# EAGLE design ESP32-S2 Parallel TFT with Touch v1.1(3.5'' ili9488) (EAGLE 6.1)
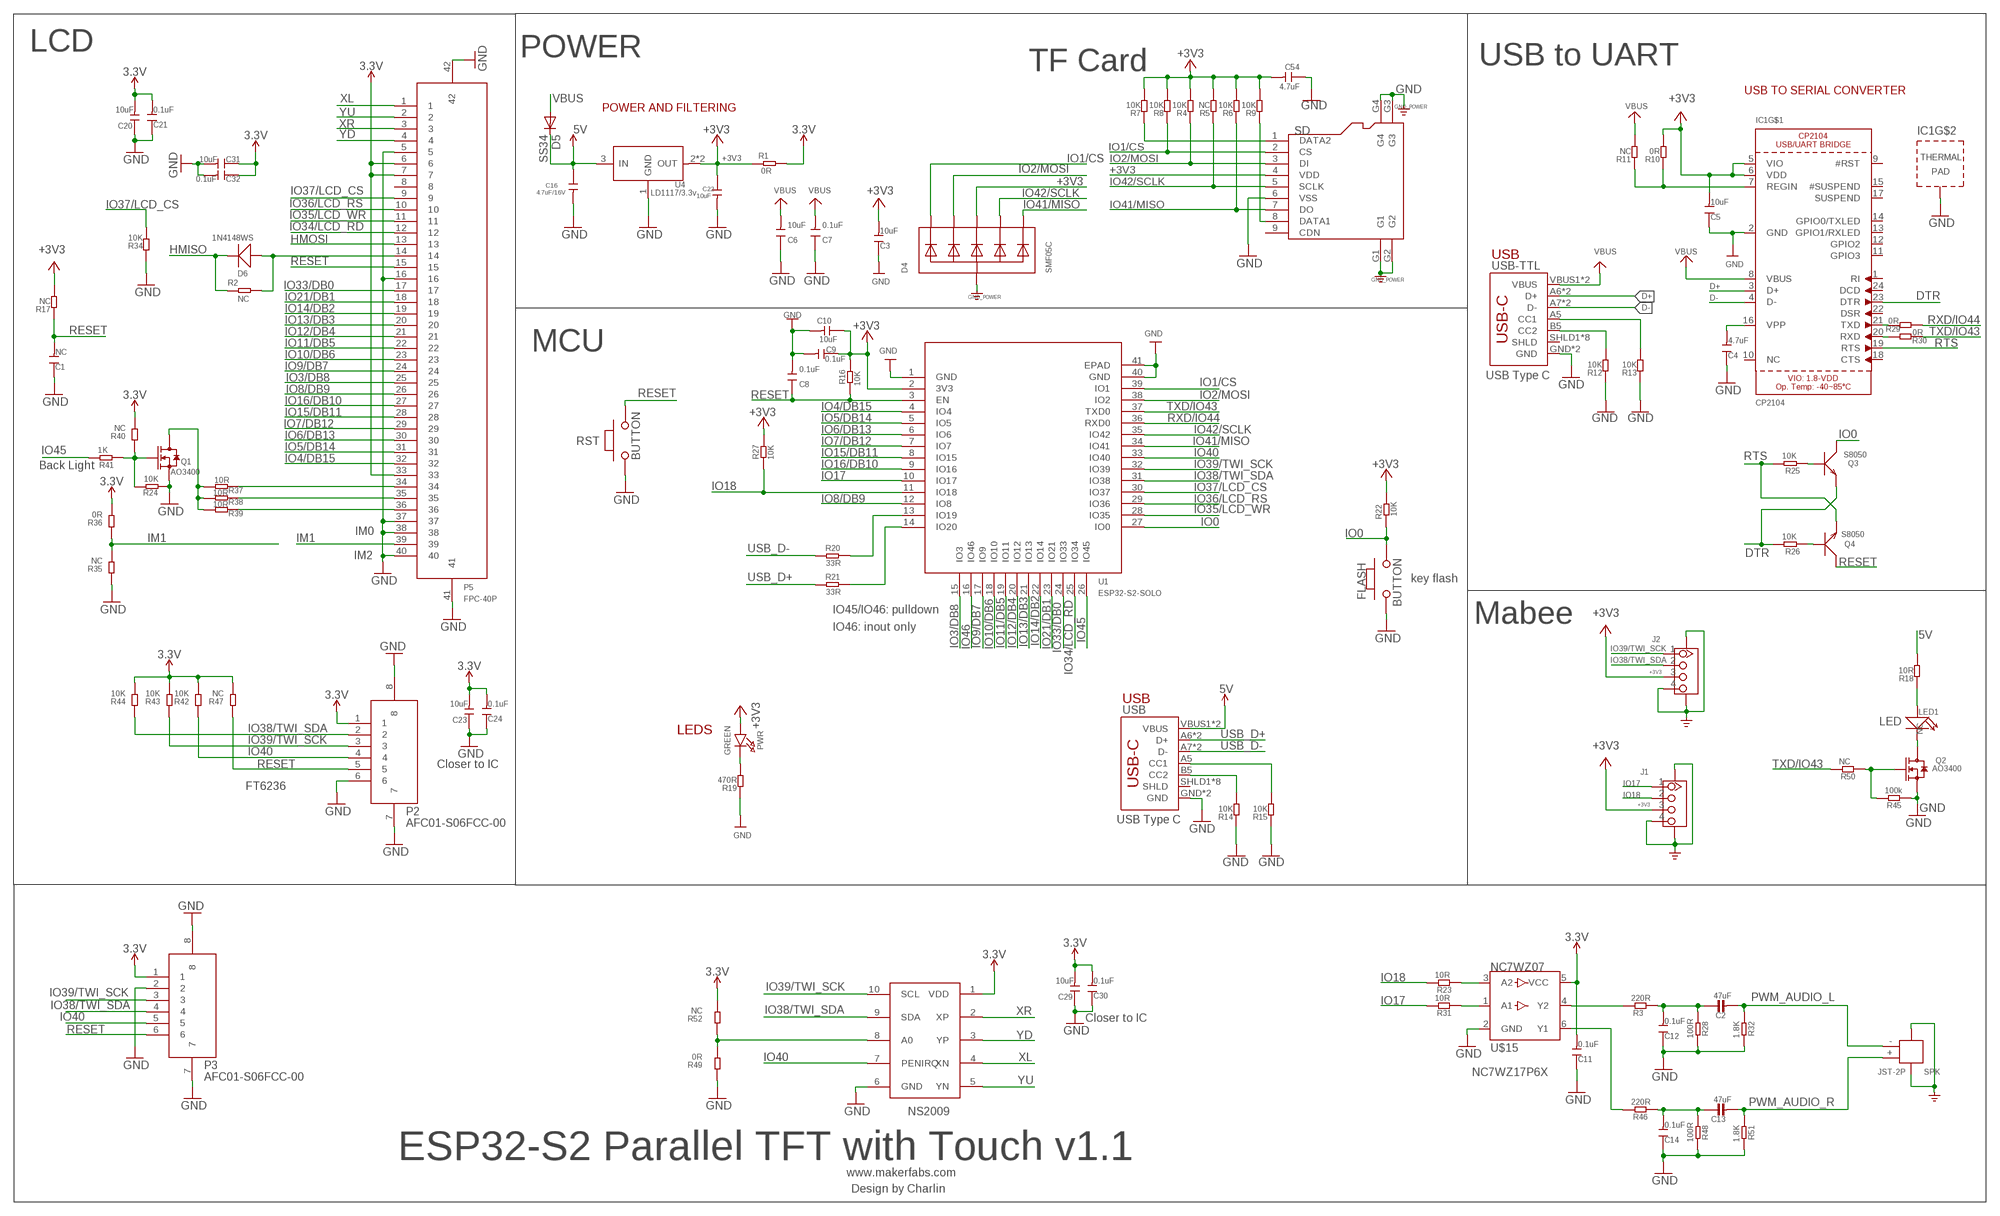
[diagram p0: schematic, sheet 1]

## Parts
C1  NC  DISCRETE_C-0603  [DISCRETE_C0603]
C2  47uF  MICROBUILDER_CAP_CERAMIC0805  [MICROBUILDER_0805]
C3  10uF  DISCRETE_C-0603  [DISCRETE_C0603]
C4  4.7uF  DISCRETE_C-0603  [DISCRETE_C0603]
C5  10uF  DISCRETE_C-0603  [DISCRETE_C0603]
C6  10uF  DISCRETE_C-0603  [DISCRETE_C0603]
C7  0.1uF  DISCRETE_C-0603  [DISCRETE_C0603]
C8  0.1uF  DISCRETE_C-0603  [DISCRETE_C0603]
C9  0.1uF  DISCRETE_C-0603  [DISCRETE_C0603]
C10  10uF  DISCRETE_C-0603  [DISCRETE_C0603]
C11  0.1uF  DISCRETE_C-0603  [DISCRETE_C0603]
C12  0.1uF  DISCRETE_C-0603  [DISCRETE_C0603]
C13  47uF  MICROBUILDER_CAP_CERAMIC0805  [MICROBUILDER_0805]
C14  0.1uF  DISCRETE_C-0603  [DISCRETE_C0603]
C16  4.7uF/16V  C-0603  [0603]
C20  10uF  DISCRETE_C-0603  [DISCRETE_C0603]
C21  0.1uF  DISCRETE_C-0603  [DISCRETE_C0603]
C22  10uF  C-0603  [0603]
C23  10uF  DISCRETE_C-0603  [DISCRETE_C0603]
C24  0.1uF  DISCRETE_C-0603  [DISCRETE_C0603]
C29  10uF  DISCRETE_C-0603  [DISCRETE_C0603]
C30  0.1uF  DISCRETE_C-0603  [DISCRETE_C0603]
C31  10uF  DISCRETE_C-0603  [DISCRETE_C0603]
C32  0.1uF  DISCRETE_C-0603  [DISCRETE_C0603]
C54  4.7uF  DISCRETE_C-0603  [DISCRETE_C0603]
D4  SMF05C  TVSARRAY_5LANE  [SOT363]
D5  SS34  DIODE-DO-214AC  [DO-214AC]
D6  1N4148WS  D'0805'  [SOD323]
FLASH  BUTTON  PB157  [157SW]
IC1  CP2104  [QFN24_4MM_SMSC]
J1  GROVE-CONNECTOR-SMD'90D'  [HW4-SMD-2.0-90D]
J2  GROVE-CONNECTOR-SMD'90D'  [HW4-SMD-2.0-90D]
LED1  NC  DISCRETE_LED3528  [DISCRETE_LED-3528]
P2  AFC01-S06FCC-00  [SMD8-50P-740L535W]
P3  AFC01-S06FCC-00  [SMD8-50P-740L535W]
P5  FPC-40P  [SMD42-50P-2560L490W]
PWR  GREEN  LED0805_NOOUTLINE  [CHIPLED_0805_NOOUTLINE]
Q1  AO3400  MOSFET-N'SOT23'  [SOT23@1]
Q2  AO3400  MOSFET-N'SOT23'  [SOT23@1]
Q3  S8050  TRANSISTOR-NPN-SOT23  [SOT23]
Q4  S8050  TRANSISTOR-NPN-SOT23  [SOT23]
R1  0R  R-0603  [R0603]
R2  NC  R-0603  [R0603]
R3  220R  R-0603  [R0603]
R4  10K  DISCRETE_R-0603  [DISCRETE_R0603]
R5  NC  DISCRETE_R-0603  [DISCRETE_R0603]
R6  10K  DISCRETE_R-0603  [DISCRETE_R0603]
R7  10K  DISCRETE_R-0603  [DISCRETE_R0603]
R8  10K  DISCRETE_R-0603  [DISCRETE_R0603]
R9  10K  DISCRETE_R-0603  [DISCRETE_R0603]
R10  0R  DISCRETE_R-0603  [DISCRETE_R0603]
R11  NC  DISCRETE_R-0603  [DISCRETE_R0603]
R12  10K  DISCRETE_R-0603  [DISCRETE_R0603]
R13  10K  DISCRETE_R-0603  [DISCRETE_R0603]
R14  10K  DISCRETE_R-0603  [DISCRETE_R0603]
R15  10K  DISCRETE_R-0603  [DISCRETE_R0603]
R16  10K  R-0603  [R0603]
R17  NC  DISCRETE_R-0603  [DISCRETE_R0603]
R18  10R  DISCRETE_R-0603  [DISCRETE_R0603]
R19  470R  DISCRETE_R-0603  [DISCRETE_R0603]
R20  33R  R-0603  [R0603]
R21  33R  R-0603  [R0603]
R22  10K  R-0603  [R0603]
R23  10R  R-0603  [R0603]
R24  10K  DISCRETE_R-0603  [DISCRETE_R0603]
R25  10K  R-0603  [R0603]
R26  10K  R-0603  [R0603]
R27  10K  R-0603  [R0603]
R28  100R  R-0603  [R0603]
R29  0R  R-0603  [R0603]
R30  0R  R-0603  [R0603]
R31  10R  R-0603  [R0603]
R32  1.8K  R-0603  [R0603]
R34  10K  DISCRETE_R-0603  [DISCRETE_R0603]
R35  NC  DISCRETE_R-0603  [DISCRETE_R0603]
R36  0R  DISCRETE_R-0603  [DISCRETE_R0603]
R37  10R  DISCRETE_R-0603  [DISCRETE_R0603]
R38  10R  DISCRETE_R-0603  [DISCRETE_R0603]
R39  10R  DISCRETE_R-0603  [DISCRETE_R0603]
R40  NC  DISCRETE_R-0603  [DISCRETE_R0603]
R41  1K  DISCRETE_R-0603  [DISCRETE_R0603]
R42  10K  DISCRETE_R-0603  [DISCRETE_R0603]
R43  10K  DISCRETE_R-0603  [DISCRETE_R0603]
R44  10K  DISCRETE_R-0603  [DISCRETE_R0603]
R45  100k  R-0603  [R0603]
R46  220R  R-0603  [R0603]
R47  NC  DISCRETE_R-0603  [DISCRETE_R0603]
R48  100R  R-0603  [R0603]
R49  0R  DISCRETE_R-0603  [DISCRETE_R0603]
R50  NC  R-0603  [R0603]
R51  1.8K  R-0603  [R0603]
R52  NC  DISCRETE_R-0603  [DISCRETE_R0603]
RST  BUTTON  PB157  [157SW]
SD  HOLDER-MICROSD-9P  [9P-SMD-W/-RING]
SPK  JST-2P  JST-2P-SMD'2.0'  [HW2-SMD-2.0-90D]
U1  ESP32­S2­SOLO  [ESP32-­S2-­SOLO]
U4  LD1117/3.3v  LD1117'SOT89'  [SOT89]
U8  NS2009  [MSOP10]
U$15  NC7WZ07  [SC70-6]
USB  USB_C5  [USB-C-16P-5]
USB-TTL  USB_C5  [USB-C-16P-5]

## Nets
3.3V: C11.2 C20.2 C21.2 C23.2 C24.2 C29.2 C30.2 C31.1 C32.1 P2.1 P3.1 P5.6 P5.7 P5.33 R1.2 R36.2 R40.2 R42.2 R43.2 R44.2 R47.2 R52.2 U8.1(VDD) U$15.5(VCC)
5V: C16.1 D5.C R18.2 U4.3(IN) USB.VBUS1(VBUS) USB.VBUS2(VBUS)
+3V3: C3.2 C5.2 C9.1 C10.1 C22.1 C54.2 D4.4(C3) IC1.5(VIO) IC1.6(VDD) J1.3 J2.3 PWR.A R1.1 R4.2 R5.2 R6.2 R7.2 R8.2 R9.2 R10.2 R16.2 R17.2 R22.2 R27.2 SD.4(VDD) U1.2(3V3) U4.2(OUT) U4.4(OUT)
D+: IC1.3(D+) USB-TTL.A6(D+) USB-TTL.B6(D+)
D-: IC1.4(D-) USB-TTL.A7(D-) USB-TTL.B7(D-)
DTR: IC1.23(DTR) Q3.2(E) R26.2
GND: C1.1 C3.1 C4.1 C5.1 C6.1 C7.1 C8.2 C9.2 C10.2 C11.1 C12.1 C14.1 C16.2 C20.1 C21.1 C22.2 C23.1 C24.1 C29.1 C30.1 C31.2 C32.2 C54.1 D4.2(A) FLASH.1 IC1.2(GND) IC1.THERM(TP) J1.4 J1.SS1 J1.SS2 J2.4 J2.SS1 J2.SS2 P2.6 P2.7 P2.8 P3.2 P3.7 P3.8 P5.5 P5.16 P5.37 P5.38 P5.40 P5.41 P5.42 Q1.2(S) Q2.2(S) R12.1 R13.1 R14.1 R15.1 R19.1 R24.1 R28.2 R32.2 R34.1 R35.1 R45.1 R48.2 R49.1 R51.2 RST.1 SD.6(VSS) SD.G1 SD.G2 SD.G3 SD.G4 SPK.3 SPK.4 U1.1(GND) U1.40(GND) U1.41(EPAD) U4.1(GND) U8.6(GND) U$15.2(GND) USB-TTL.GND USB-TTL.GND2(GND) USB.GND USB.GND2(GND) ; supply symbol labelled GND_POWER
HMISO: D6.- R2.1
HMOSI: P5.13
IM1: P5.39 R35.2 R36.1
IO0: FLASH.2 Q3.3(C) R22.1 U1.27(IO0)
IO1/CS: D4.1(C1) R8.1 SD.2(CS) U1.39(IO1)
IO2/MOSI: D4.3(C2) R4.1 SD.3(DI) U1.38(IO2)
IO3/DB8: P5.25 U1.15(IO3)
IO4/DB15: P5.32 U1.4(IO4)
IO5/DB14: P5.31 U1.5(IO5)
IO6/DB13: P5.30 U1.6(IO6)
IO7/DB12: P5.29 U1.7(IO7)
IO8/DB9: P5.26 U1.12(IO8)
IO9/DB7: P5.24 U1.17(IO9)
IO10/DB6: P5.23 U1.18(IO10)
IO11/DB5: P5.22 U1.19(IO11)
IO12/DB4: P5.21 U1.20(IO12)
IO13/DB3: P5.20 U1.21(IO13)
IO14/DB2: P5.19 U1.22(IO14)
IO15/DB11: P5.28 U1.8(IO15)
IO16/DB10: P5.27 U1.9(IO16)
IO17: J1.1 R31.2 U1.10(IO17)
IO18: J1.2 R23.2 R27.1 U1.11(IO18)
IO21/DB1: P5.18 U1.23(IO21)
IO33/DB0: P5.17 U1.24(IO33)
IO34/LCD_RD: P5.12 U1.25(IO34)
IO35/LCD_WR: P5.11 U1.28(IO35)
IO36/LCD_RS: P5.10 U1.29(IO36)
IO37/LCD_CS: P5.9 R34.2 U1.30(IO37)
IO38/TWI_SDA: J2.2 P2.2 P3.4 R44.1 U1.31(IO38) U8.9(SDA)
IO39/TWI_SCK: J2.1 P2.3 P3.3 R43.1 U1.32(IO39) U8.10(SCL)
IO40: P2.4 P3.5 R42.1 U1.33(IO40) U8.7(PENIRQ)
IO41/MISO: D4.6(C5) R6.1 SD.7(DO) U1.34(IO41)
IO42/SCLK: D4.5(C4) R5.1 SD.5(SCLK) U1.35(IO42)
IO45: R41.2 U1.26(IO45)
IO46: U1.16(IO46)
N$1: C4.2 IC1.16(VPP)
N$2: Q4.1(B) R26.1
N$3: Q3.1(B) R25.1
N$4: D6.+ P5.14 R2.2
N$5: Q2.1(G) R45.2 R50.1
N$6: R15.2 USB.A5(CC1)
N$7: PWR.C R19.2
N$8: LED1.1(+) R18.1
N$9: LED1.2(-) Q2.3(D)
N$10: R13.2 USB-TTL.A5(CC1)
N$11: R12.2 USB-TTL.B5(CC2)
N$12: IC1.7(REGIN) R10.1 R11.1
N$13: R3.2 U$15.4(Y2)
N$14: R14.2 USB.B5(CC2)
N$15: R20.2 U1.13(IO19)
N$16: R21.2 U1.14(IO20)
N$17: C2.1 C12.2 R3.1 R28.1
N$18: IC1.21(TXD) R29.2
N$19: IC1.20(RXD) R30.2
N$20: P5.34 R37.1
N$21: P5.35 R38.1
N$22: P5.36 R39.1
N$23: Q1.1(G) R24.2 R40.1 R41.1
N$24: Q1.3(D) R37.2 R38.2 R39.2
N$25: R49.2 R52.1 U8.8(A0)
N$26: R46.2 U$15.6(Y1)
N$27: R23.1 U$15.3(A2)
N$28: R31.1 U$15.1(A1)
N$29: C13.1 C14.2 R46.1 R48.1
N$47: R7.1 SD.1(DATA2)
N$48: R9.1 SD.8(DATA1)
PWM_AUDIO_L: C2.2 R32.1 SPK.-
PWM_AUDIO_R: C13.2 R51.1 SPK.+
RESET: C1.2 C8.1 P2.5 P3.6 P5.15 Q4.3(C) R16.1 R17.1 R47.1 RST.2 U1.3(EN)
RTS: IC1.19(RTS) Q4.2(E) R25.2
RXD/IO44: R29.1 U1.36(RXD0)
TXD/IO43: R30.1 R50.2 U1.37(TXD0)
USB_D+: R21.1 USB.A6(D+) USB.B6(D+)
USB_D-: R20.1 USB.A7(D-) USB.B7(D-)
VBUS: C6.2 C7.2 D5.A IC1.8(VBUS) R11.2 USB-TTL.VBUS1(VBUS) USB-TTL.VBUS2(VBUS)
XL: P5.1 U8.4(XN)
XR: P5.3 U8.2(XP)
YD: P5.4 U8.3(YP)
YU: P5.2 U8.5(YN)
Unconnected: IC1.1(RI) IC1.9(#RST) IC1.10(NC) IC1.11(GPIO3) IC1.12(GPIO2) IC1.13(GPIO1/RXLED) IC1.14(GPIO0/TXLED) IC1.15(#SUSPEND) IC1.17(SUSPEND) IC1.18(CTS) IC1.22(DSR) IC1.24(DCD) P5.8 SD.9(CDN) USB-TTL.SHLD1(SHLD) USB-TTL.SHLD2(SHLD) USB-TTL.SHLD3(SHLD) USB-TTL.SHLD4(SHLD) USB-TTL.SHLD5(SHLD) USB-TTL.SHLD6(SHLD) USB-TTL.SHLD7(SHLD) USB-TTL.SHLD8(SHLD) USB.SHLD1(SHLD) USB.SHLD2(SHLD) USB.SHLD3(SHLD) USB.SHLD4(SHLD) USB.SHLD5(SHLD) USB.SHLD6(SHLD) USB.SHLD7(SHLD) USB.SHLD8(SHLD)

## Notes on the sheet
- LCD | POWER
- TF Card | USB to UART
- USB TO SERIAL CONVERTER
- POWER AND FILTERING
- USB
- MCU
- USB Type C
- Back Light
- IM0
- IM2
- key flash
- IO45/IO46: pulldown
- Mabee
- IO46: inout only
- USB
- LED
- LEDS
- Closer to IC
- FT6236
- USB Type C
- Closer to IC
- NC7WZ17P6X
- NS2009
- ESP32-S2 Parallel TFT with Touch v1.1
- www.makerfabs.com
- Design by Charlin

## Library data of the parts
C1 C3-C12 C14 C20 C21 C23 C24 C29-C32 C54 = A9G:DISCRETE_C*: Ceramic Capacitors
C2 C13 = OLED_128x32_I2C:MICROBUILDER_CAP_CERAMIC: Ceramic Capacitors 0402 - 0402 Surface Mount Capacitors 16pF 50V 5% [Digikey: 445-4899-2-ND] 18pF 50V 5% [Digikey: 490-1281-2-ND] 22pF 50V 5% [Digikey: 490-1283-2-ND] 68pF 50V 5% [Digikey: 490-1289-2-ND] 0.1uF 10V 10% [Digikey: 490-1318-2-ND] 1.0uF 6.3V 10% [Digikey: 490-1320-2-ND] 0603 - 0603 Surface Mount Capacitors 16 pF 50V 5% [Digikey: 445-5051-2-ND] 22 pF 50V [Digikey: PCC220ACVTR-ND] 33 pF 50V 5% [Digikey: 490-1415-1-ND] 56pF 50V 5% [Digikey: 490-1421-1-ND] 220pF 50V 5% [Digikey: 445-1285-1-ND] 680 pF 50V 2200 pF 50V 5% C0G [Digikey: 445-1297-1-ND] 5600 pF 100V 5% X7R [Digikey: 478-3711-1-ND] 0.1 ¦ÌF 25V 10% [Digikey: PCC2277TR-ND] 0.22 ¦ÌF 16V 10% X7R [Digikey: 445-1318-1-ND] 1.0 ¦ÌF 25V 10% [Digikey: 445-5146-2-ND] 0603 - RF Specific 3pF 250V +/-0.1pF RF [Digikey: 712-1347-1-ND] 18 pF 250V 5% [Digikey: 478-3505-1-ND or 712-1322-1-ND] 56 pF 250V 5% C0G RF [Digikey: 490-4867-1-ND] 68 pF 250V RF [Digikey: 490-4868-1-ND] 0805 - 0805 Surface Mount Capacitors 220 pF 250V 2% RF Ceramic Capacitor [Digikey: 712-1398-1-ND] 1000 pF 50V 2% NP0 Ceramic Capacitor [Digikey: 478-3760-1-ND] 0.1 ¦ÌF 25V 10% Ceramic Capacitor [Digikey: PCC1828TR-ND] 1.0 ¦ÌF 16V 10% Ceramic Capacitor[Digikey: 490-1691-2-ND] 10.0 ¦ÌF 10V 10% Ceramic Capacitor[Digikey: 709-1228-1-ND] 10.0 uF 16V 10% Ceramic Capacitor [Digikey: 478-5165-2-ND] 47 uF 6.3V 20% Ceramic Capacitor [Digikey: 587-1779-1-ND or 399-5506-1-ND] 1206 - 1206 Surface Mount Capacitors 47uF 10V 20% Ceramic Capacitor [Digikey: 490-5528-1-ND or 399-5508-1-ND or 445-6010-1-ND] 100uF 6.3V -20%, +80% Y5V Ceramic Capacitor (Digikey: 490-4512-1-ND, Mouser: 81-GRM31CF50J107ZE1L)
C16 C22 = Discrete:C*: Ceramic Capacitors
D4 = microbuilder:TVSARRAY_5LANE: Voltage Transient Suppressor Array SOT363 SMF05C - 100W 5V: Digikey - SMF05CT1GOSCT-ND
D5 = diode:DIODE-: DIODE
D6 = Discrete:D*
FLASH RST = MySMD:PB157
IC1 = microbuilder:CP2104: CP2104 - USB to UART Bridge VDD Output: 3.45V
J1 J2 = Connector-new:GROVE-CONNECTOR-SMD: 4P-SMD-2.0:320110030;4P-SMD-2.0-90D:320110032
LED1 = Relay:DISCRETE_LED*
P2 P3 = self:AFC01-S06FCC-00
P5 = self:FPC-40P
PWR = microbuilder:LED: LED 0603 - 0603 Surface Mount Package 2mA: Green LED - Low Power (3.9mcd, 2ma, 1.7Vf) - Digikey: 475-2709-2-ND Orange LED - Low Power (9.8mcd, 2ma, 1.8Vf) - Digikey: 475-1194-2-ND Red LED - Low Power (5mcd, 2ma, 1.8Vf) - Digikey: 475-1195-2-ND Yellow LED - Low Power (7mcd, 2ma, 1.8Vf) - Digikey: 475-1196-2-ND 5mA: Blue LED - Low Power (17mcd, 5ma, 2.9Vf) - Digikey: LNJ937W8CRACT-ND 0805 - 0805 Surface Mount Package 2mA: Red LED (8.8mcd, 2mA, 1.8Vf, Clear) - Low Power [Digikey: 475-2510-1-ND] Green LED (5mcd, 2mA, 1.8Vf, Clear) - Low Power [Digikey: 475-2730-1-ND] Yellow LED (11.3mcd, 2mA, 1.8Vf, Clear) - Low Power [Digikey: 475-2555-1-ND] 20mA: Red LED (104mcd, 20mA, Diffused) - LS R976 [Digikey: 475-1278-6-ND] Red LED (12mcd, 20mA, 2.0Vf, Clear) - APT2012EC [Digikey: 754-1128-1-ND] Green LED (15mcd, 20mA, 2.2Vf, Clear) - APT2012GC [Digikey: 754-1131-1-ND] Orange LED (160mcd, 20mA, 2.1Vf, Clear) - APT2012SECK [Digikey: 754-1130-1-ND] 1206 - 1206 Surface Mount Package Green LED (26mcd, 20mA, Diffused) - LG N971 [Digikey: 475-1407-6-ND] Red LED (15mcd, 20mA, Diffused) - LH N974 [Digikey: 475-1416-6-ND] Cree - Cree High-Power Surface Mount LEDs XPEBWT-L1-0000-00D50 - White 111lm 350mA 2.9Vf 6200K 110° XTEAWT-00-0000-00000LEE3 - White 114lm 350mA 2.85Vf 5000K 115° Everlight - Everlight 45-21 Series Surface Mount LEDs 45-21/QK2C-B2832AC2CB2/2T - Warm White 2000mcd 20mA 3.25Vf 3050K 120° 45-21/LK2C-B38452C4CB2/2T - Nuetral White 2000mcd 20mA 3.25Vf 4150K 120° 45-21/LK2C-B50634C6CB2/2T - Cold White 2200mcd 20mA 3.25Vf 5650K 120° PLCC2 Reverse Mount LS T77K-J1L2-1-0-2-R18-Z - Red 11.25mcd 2mA 1.8Vf 630nm 120° LO T77K-L1M2-24-Z - Orange 19.6mcd 2mA 1.8Vf 606nm 120° LY T77K-K2M1-26-Z - Yellow 15.7mcd 2mA 1.8Vf 587nm 120°
Q1 Q2 = Discrete:MOSFET-N: IRLL014: http://www.vishay.com/docs/91319/sihll014.pdf
Q3 Q4 = Discrete:TRANSISTOR-NPN*: NPN audion
R1-R3 R16 R20-R23 R25-R32 R45 R46 R48 R50 R51 = Discrete:R*
R4-R15 R17-R19 R24 R34-R44 R47 R49 R52 = A9G:DISCRETE_R*
SD = Connector:HOLDER-MICROSD-9P
SPK = Connector-new:JST-2P-SMD: 2P-SMD-1.0-90D:320110054;2P-SMD-2.0-90D:320110026
U1 = self:ESP32­S2­SOLO
U4 = IC:LD1117: Low Drop Fixed And Adjustable Positive Voltage Regulators http://www.datasheetcatalog.org/datasheet/SGSThomsonMicroelectronics/mXuqtqv.pdf
U8 = NS2009:NS2009
U$15 = SparkFun-Retired:NC7WZ07: Ultra-high speed dual open-drain output buffer (non-inverting) Retired: IC-09351
USB USB-TTL = USBC:USB_C: USB Type C 16Pin Connector Super Speed pins not available on the 16-pin purely SMD connector so this part is best for USB 2.0 implementations. D1 and D2 are tied together enabling D+/- no matter which way the cable is plugged into the connector. The two channel configuration pins (CC1/2) are exposed. These are normally connected to ground via 5.1k resistors but can be reconfigured for high current/high power applications.

## Net classes
1 vbat: width 0.254 mm, drill 0.305 mm, clearance 0.152 mm

## Board
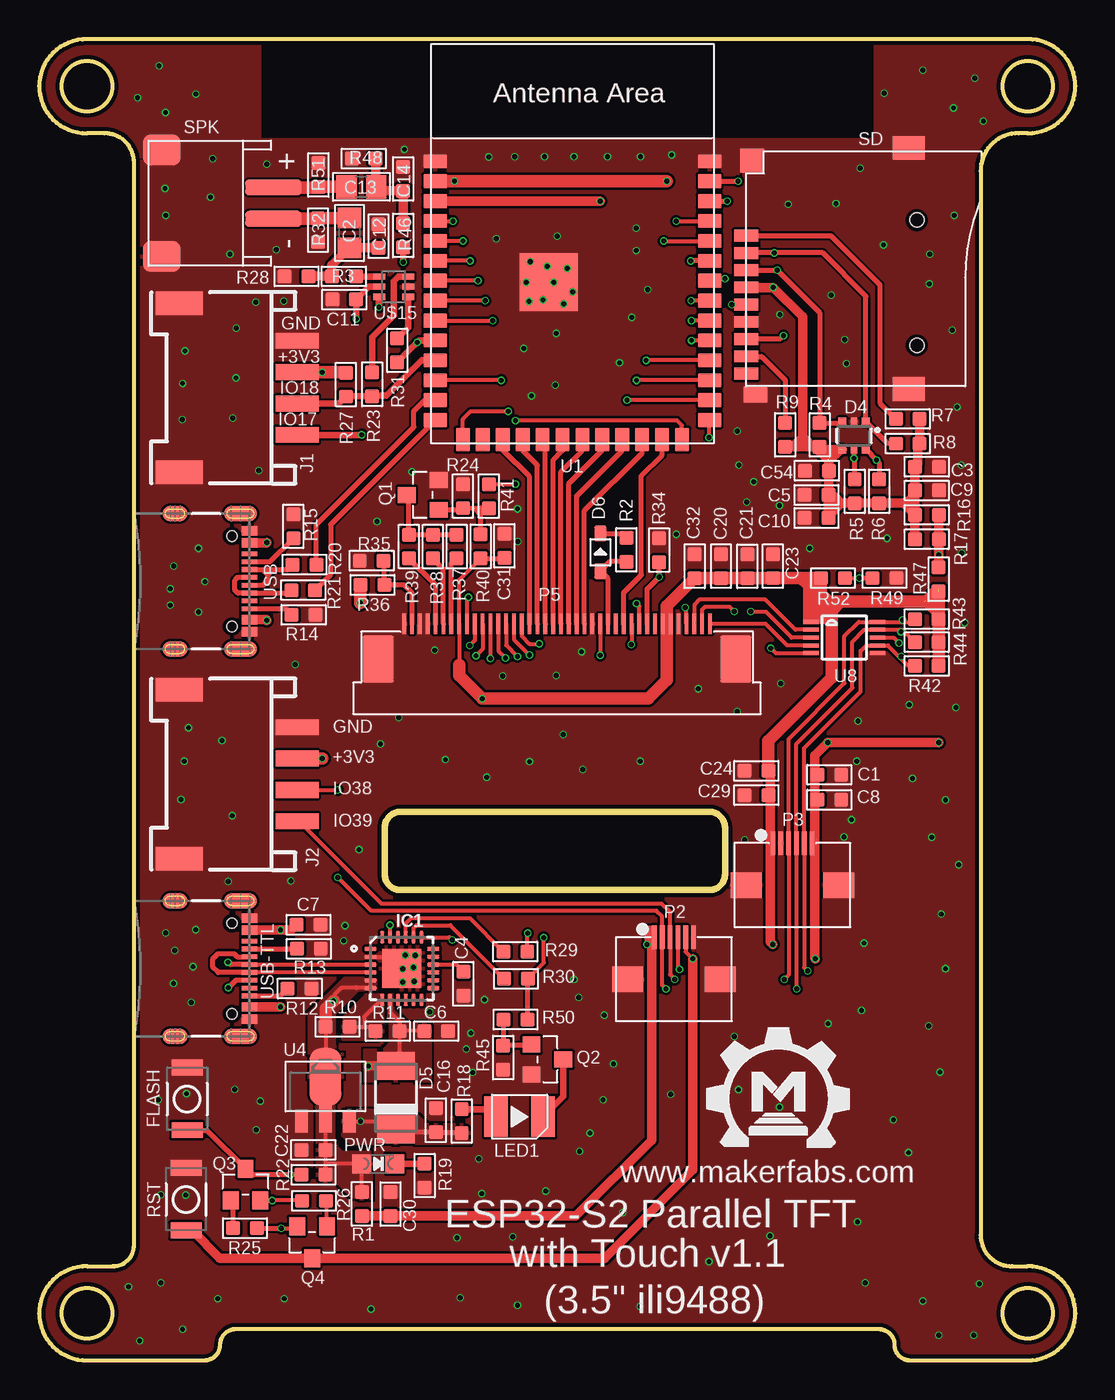
[diagram p1: board, top side]
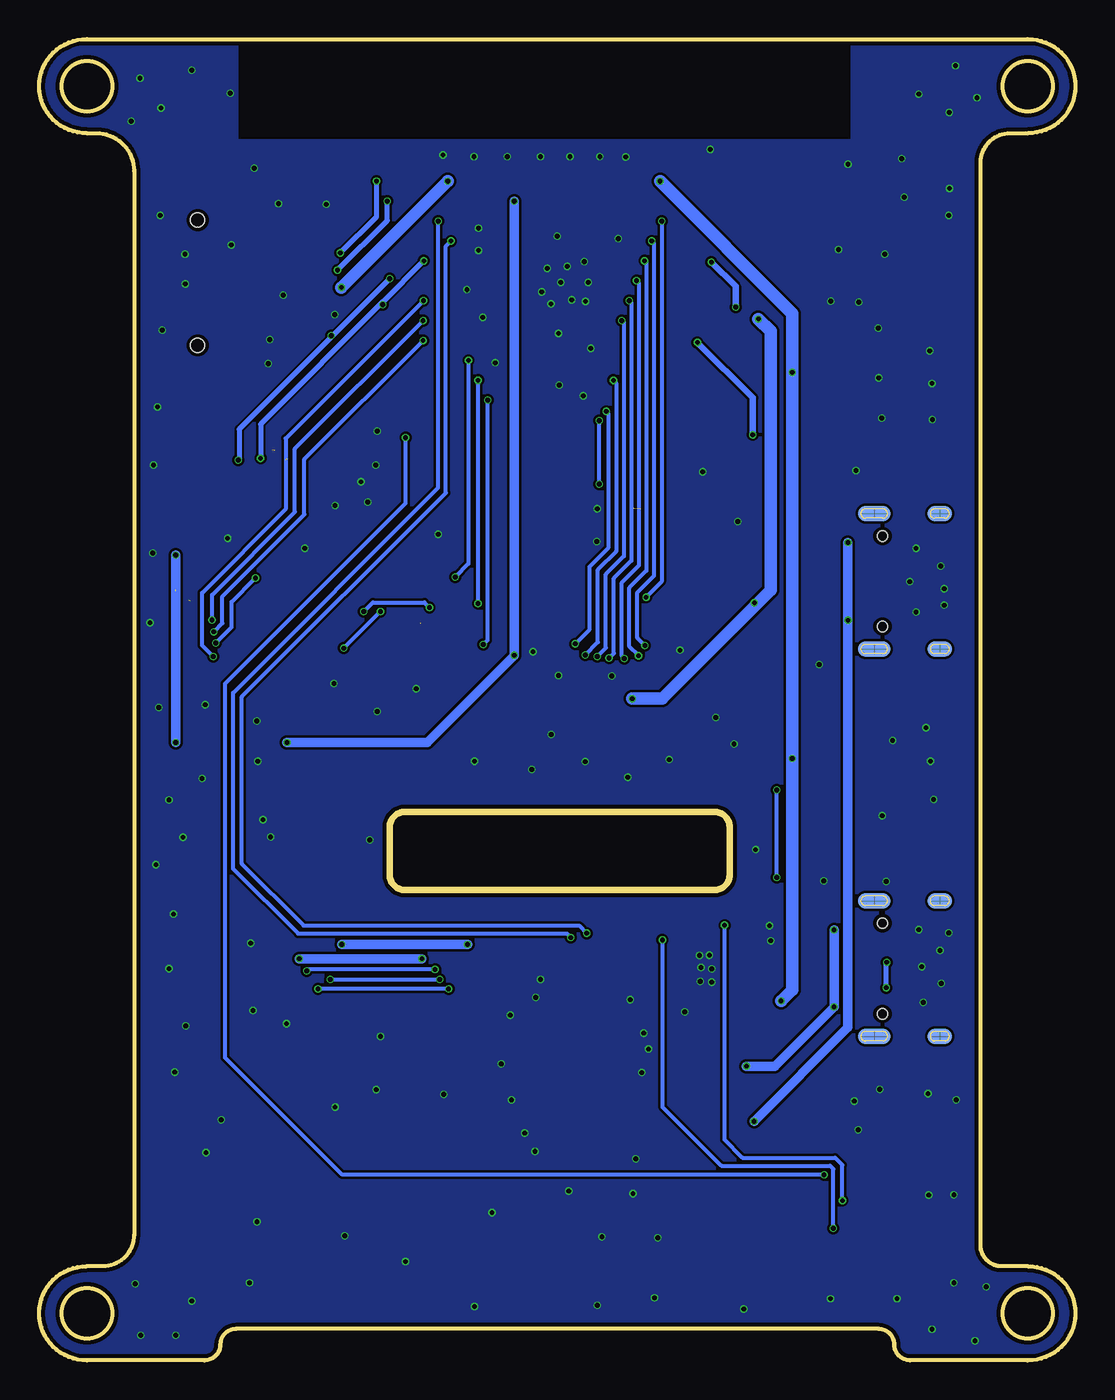
[diagram p2: board, bottom side, seen from below]

Size 66.1 x 84.3 mm. Coordinates in mm from the lower left corner, seen from the top.
Outline: 55.55,0 63.05,0 arc182 63.05,6 62.05,6 arc-90 60.05,8 60.05,75.9 arc-90 62.45,78.3 63.05,78.3 arc182 63.05,84.3 3.05,84.3 arc182 3.05,78.3 4.17,78.3 arc-90 6.05,76.42 6.05,7.34 arc-90 4.7,6 3.05,6 arc182 3.05,0 10.55,0 arc90 11.55,1 arc-90 12.55,2 53.55,2 arc-90 54.55,1 arc90 55.55,0
Outline: 23.05,35 42.75,35 arc-90 43.75,34 43.75,31 arc-90 42.75,30 23.05,30 arc-90 22.05,31 22.05,34 arc-90 23.05,35
Outline: circle at 3.05,81.3 radius 1.6
Outline: circle at 3.05,3 radius 1.6
Outline: circle at 63.05,3 radius 1.6
Outline: circle at 63.05,81.3 radius 1.6
Copper layers (1*16): Top 0.035mm / dielectric 1.5mm / Bottom 0.035mm
Design rules: minimum track width 6mil, minimum drill 10mil, track to track 6mil, track to pad 6mil, pad to pad 6mil, via to via 6mil, smd to smd 0mil, copper to edge 10mil, drill to drill 10mil, minimum pad ring 3mil, minimum via ring 3mil, stop-mask expansion 2mil, vias tented up to drill 100mil, thermal gap 0mil
tRestrict: area 14.2,78 to 53.2,85
bRestrict: area 14.4,77.9 to 53.4,84.9

### Footprints (pad centres in the part's own frame; a part is rotated, then mirrored left to right if it is on the bottom)
DISCRETE_C0603 = smd 0.889 x 0.889: 1 -0.762,0; 2 0.762,0
MICROBUILDER_0805 = smd 1.3 x 1.5: 1 -0.95,0; 2 0.95,0
0603 = smd 0.889 x 0.889: 1 -0.762,0; 2 0.762,0
SOT363 = smd 0.5 x 0.5: 1 -0.75,-0.9; 3 0.75,-0.9; 4 0.75,0.9; 6 -0.75,0.9 | smd 0.4 x 0.5: 2 0,-0.9; 5 0,0.9
DO-214AC = smd 1.8 x 2.4: A 2.025,0; C -2.025,0
SOD323 = smd 1 x 0.8: + -1.2,0; - 1.2,0
157SW = smd 1.016 x 1.981: 1 0,0; 2 4,0
QFN24_4MM_SMSC = smd 0.8 x 0.28: 1 -2,1.25; 2 -2,0.75; 3 -2,0.25; 4 -2,-0.25; 5 -2,-0.75; 6 -2,-1.25; 13 2,-1.25; 14 2,-0.75; 15 2,-0.25; 16 2,0.25; 17 2,0.75; 18 2,1.25 | smd 0.28 x 0.8: 7 -1.25,-2; 8 -0.75,-2; 9 -0.25,-2; 10 0.25,-2; 11 0.75,-2; 12 1.25,-2; 19 1.25,2; 20 0.75,2; 21 0.25,2; 22 -0.25,2; 23 -0.75,2; 24 -1.25,2 | smd 2.5 x 2.5: THERM 0,0
HW4-SMD-2.0-90D = smd 1.01 x 2.74: 1 -3,-0.1; 2 -1,-0.1; 3 1,-0.1; 4 3,-0.1 | smd 1.5 x 3: SS1 -5.4,7.4; SS2 5.4,7.4
DISCRETE_LED-3528 = smd 1.5 x 2.6: 1 -1.5,0; 2 1.5,0
SMD8-50P-740L535W = smd 0.3 x 1.5: 1 -1.25,0; 2 -0.75,0; 3 -0.25,0; 4 0.25,0; 5 0.75,0; 6 1.25,0 | smd 2 x 1.6: 7 2.95,-2.68; 8 -2.95,-2.68
SMD42-50P-2560L490W = smd 0.3 x 1.3: 1 9.75,0; 2 9.25,0; 3 8.75,0; 4 8.25,0; 5 7.75,0; 6 7.25,0; 7 6.75,0; 8 6.25,0; 9 5.75,0; 10 5.25,0; 11 4.75,0; 12 4.25,0; 13 3.75,0; 14 3.25,0; 15 2.75,0; 16 2.25,0; 17 1.75,0; 18 1.25,0; 19 0.75,0; 20 0.25,0; 21 -0.25,0; 22 -0.75,0; 23 -1.25,0; 24 -1.75,0; 25 -2.25,0; 26 -2.75,0; 27 -3.25,0; 28 -3.75,0; 29 -4.25,0; 30 -4.75,0; 31 -5.25,0; 32 -5.75,0; 33 -6.25,0; 34 -6.75,0; 35 -7.25,0; 36 -7.75,0; 37 -8.25,0; 38 -8.75,0; 39 -9.25,0; 40 -9.75,0 | smd 2 x 3: 41 -11.4,-2.25; 42 11.4,-2.25
CHIPLED_0805_NOOUTLINE = smd 1.2 x 1.2: A 0,-1.05; C 0,1.05
SOT23@1 = smd 1.016 x 1.143: 1 -0.95,-1.016; 2 0.95,-1.016; 3 0,1.016
SOT23 = smd 1.016 x 1.143: 1 -0.95,-1.016; 2 0.95,-1.016; 3 0,1.016
R0603 = smd 0.889 x 0.889: 1 -0.762,0; 2 0.762,0
DISCRETE_R0603 = smd 0.889 x 0.889: 1 -0.762,0; 2 0.762,0
9P-SMD-W/-RING = smd 1.524 x 0.762: 1 0,4.4; 2 0,3.3; 3 0,2.2; 4 0,1.1; 5 0,0; 6 0,-1.1; 7 0,-2.2; 8 0,-3.3; 9 0,-4.4 | smd 1.524 x 1.016: G1 0.6,-5.746 | smd 2.032 x 1.524: G2 10.373,-5.4; G3 10.373,10 | smd 1.524 x 1.524: G4 0.392,9.181 | hole 0.889: 10.9,-2.6; 10.9,5.4
HW2-SMD-2.0-90D = smd 2 x 2.4: 3 3.4,-2.181; 4 -3.4,-2.181 | smd 1 x 3.6: + -1,4.953; - 1,4.953
ESP32-­S2-­SOLO = smd 1.5 x 0.9: 1 -8.75,5.26; 2 -8.75,3.99; 3 -8.75,2.72; 4 -8.75,1.45; 5 -8.75,0.18; 6 -8.75,-1.09; 7 -8.75,-2.36; 8 -8.75,-3.63; 9 -8.75,-4.9; 10 -8.75,-6.17; 11 -8.75,-7.44; 12 -8.75,-8.71; 13 -8.75,-9.98; 14 -8.75,-11.25; 27 8.75,-11.25; 28 8.75,-9.98; 29 8.75,-8.71; 30 8.75,-7.44; 31 8.75,-6.17; 32 8.75,-4.9; 33 8.75,-3.63; 34 8.75,-2.36; 35 8.75,-1.09; 36 8.75,0.18; 37 8.75,1.45; 38 8.75,2.72; 39 8.75,3.99; 40 8.75,5.26 | smd 0.9 x 1.5: 15 -6.985,-12.5; 16 -5.715,-12.5; 17 -4.445,-12.5; 18 -3.175,-12.5; 19 -1.905,-12.5; 20 -0.635,-12.5; 21 0.635,-12.5; 22 1.905,-12.5; 23 3.175,-12.5; 24 4.445,-12.5; 25 5.715,-12.5; 26 6.985,-12.5 | smd 3.7 x 3.7: 41 -1.5,-2.46
SOT89 = smd 0.8 x 1.4: 1 -1.524,-1.905; 3 1.524,-1.905 | smd 0.8 x 1.9: 2 0,-1.651 | smd 2.032 x 3.65: 4 0,0.94
MSOP10 = smd 0.25 x 1: 1 -1,-2.113; 2 -0.5,-2.113; 3 0,-2.113; 4 0.5,-2.113; 5 1,-2.113; 6 1,2.113; 7 0.5,2.113; 8 0,2.113; 9 -0.5,2.113; 10 -1,2.113
SC70-6 = smd 0.4 x 0.75: 1 -0.65,-0.925; 2 0,-0.925; 3 0.65,-0.925; 4 0.65,0.925; 5 0,0.925; 6 -0.65,0.925
USB-C-16P-5 = smd 0.3 x 1: A5 -1.25,-0.34; A6 -0.25,-0.34; A7 0.25,-0.34; A8 1.25,-0.34; B5 1.75,-0.34; B6 0.75,-0.34; B7 -0.75,-0.34; B8 -1.75,-0.34 | smd 0.6 x 1: GND -3.225,-0.34; GND2 3.225,-0.34; VBUS1 -2.45,-0.34; VBUS2 2.45,-0.34 | smd 1 x 2.1: SHLD1 -4.32,-0.915; SHLD2 4.32,-0.915 | smd 1 x 2.1 bottom: SHLD3 -4.32,-0.915; SHLD4 4.32,-0.915 | smd 1 x 1.6: SHLD5 -4.32,-5.095; SHLD8 4.32,-5.095 | smd 1 x 1.6 bottom: SHLD6 -4.32,-5.095; SHLD7 4.32,-5.095 | hole 0.65: -2.89,-1.445; 2.89,-1.445

### Placement (x,y rotation side)
C1  50.4,37.36 180 top
C2  19.79,71.93 90 top
C3  56.62,57.02 180 top
C4  27.05,24.03 90 top
C5  49.58,55.22 0 top
C6  25.33,21.01 180 top
C7  17.17,27.79 180 top
C8  50.4,35.76 0 top
C9  56.62,55.5 0 top
C10  49.58,53.75 180 top
C11  19.46,67.69 0 top
C12  21.64,71.73 270 top
C13  20.55,74.88 180 top
C14  23.22,75.39 270 top
C16  25.3,15.32 90 top
C20  43.49,50.68 270 top
C21  45.17,50.67 270 top
C22  17.49,13.43 180 top
C23  46.8,50.68 270 top
C24  45.75,37.61 0 top
C29  45.75,36.06 0 top
C30  22.41,9.97 270 top
C31  29.68,51.97 90 top
C32  41.81,50.67 90 top
C54  49.61,56.76 0 top
D4  51.98,59 180 top
D5  22.76,16.76 90 top
D6  35.79,51.56 90 top
FLASH  9.44,18.69 270 top
IC1  23.13,25 0 top
J1  16.35,62.05 90 top
J2  16.35,37.4 90 top
LED1  30.64,15.54 0 top
P2  40.49,27 0 top
P3  48.05,33 0 top
P5  33.03,47 0 top
PWR  21.63,12.54 270 top
Q1  24.46,55.22 90 top
Q2  32.42,19.2 270 top
Q3  13.16,11.21 0 top
Q4  17.41,7.54 180 top
R1  20.58,9.98 270 top
R2  37.46,51.72 270 top
R3  19.43,69.16 0 top
R4  49.79,59.05 270 top
R5  52.02,55.45 270 top
R6  53.57,55.45 270 top
R7  55.4,60.07 0 top
R8  55.4,58.5 0 top
R9  47.58,59.05 270 top
R10  19.03,21.29 180 top
R11  22.23,21.01 0 top
R12  16.61,23.72 180 top
R13  17.2,26.26 180 top
R14  16.87,47.57 180 top
R15  16.21,53.21 270 top
R16  56.62,53.95 180 top
R17  56.62,52.4 180 top
R18  26.95,15.27 270 top
R19  24.59,11.79 90 top
R20  16.92,50.77 0 top
R21  16.84,49.15 0 top
R22  17.5,11.84 0 top
R23  21.24,62.28 270 top
R24  27.03,55.14 270 top
R25  13.13,8.43 0 top
R26  17.53,10.18 180 top
R27  19.56,62.26 90 top
R28  16.41,69.16 180 top
R29  30.37,26.07 180 top
R30  30.41,24.35 180 top
R31  22.84,64.44 270 top
R32  17.78,72.11 270 top
R34  39.54,51.7 270 top
R35  21.21,51.02 0 top
R36  21.25,49.48 180 top
R37  26.63,51.92 90 top
R38  25.12,51.92 90 top
R39  23.58,51.92 90 top
R40  28.16,51.93 270 top
R41  28.68,55.14 90 top
R42  56.62,44.31 0 top
R43  56.62,47.29 0 top
R44  56.62,45.82 0 top
R45  29.59,19.32 90 top
R46  23.22,71.78 270 top
R47  57.38,49.84 270 top
R48  20.7,76.68 180 top
R49  53.92,49.92 180 top
R50  30.38,21.75 0 top
R51  17.81,75.64 90 top
R52  50.63,49.92 180 top
RST  9.37,12.29 270 top
SD  45.09,67.36 0 top
SPK  9.99,73.84 270 top
U1  34.01,71.25 0 top
U4  18.25,17.16 0 top
U8  51.35,46.12 270 top
U$1  [MAKERFABS_0.3]  43.04,13.62 0 top
U$15  22.61,68.5 90 top
USB  13.75,49.71 270 top
USB-TTL  13.75,25 270 top

### Tracks (layer width: path | path; a pad name or v marks a point on that pad's centre or on a via)
3.3V  (via drill 0.3)  (2 unrouted)
  Top 0.254: 20.48,49.46 R36.2 | P5.7 P5.6 40.03,47.24 | 26.78,44.38 P5.33 26.78,49.8 R40.2 | 49.25,49.92 49.24,49.9 U8.1 49.24,47.21 49.2,47.24 | 48.95,49 48.95,49.2 48.39,49.76 48.87,49.76 | 49,47.17 48.87,47.17 48.87,49.76 | 48.87,49.76 49.05,49.76 49.05,47.24 49.2,47.24 | 49.2,47.24 49.43,47.24 49.43,47.19 49.41,47.19 49.41,49.58 49.53,49.58 49.53,47.17 49.61,47.17 | 49.61,47.17 49.61,47.14 | 49.61,47.17 49.61,47.73 50.07,48.18 49.81,48.18 49.58,47.95 | 49.08,47.4 49.2,47.4 | P3.1 46.8,35.77 C29.2 C24.2 | P2.1 v38.77,26.54 38.74,26.58 38.74,27.61 39.14,27.61 38.99,27.46 38.97,27.46 38.97,26.78 39.07,26.68
  Top 0.305: R40.2 29.64,51.17 C31.1
  Top 0.406: U$15.5 21.03,68.5 C11.2 v20.22,66.45
  Top 0.61: R1.2 C30.2 34.23,9.21 39.07,14.05 39.07,26.68 | v46.79,26.54 46.64,26.7 46.64,37.49 C24.2 | 56.54,48.49 57.23,49.17 57.38,49.17 | 56.47,48.46 57.41,47.52 57.41,47.45
  Top 0.813: 20.48,49.46 v20.48,48.34 | R52.2 49.25,49.92 C23.2 46.79,49.91 C21.2 C20.2 C32.1 40.03,48.14 40.03,47.24 40.03,43.41 38.84,42.22 v28.26,42.22 26.78,43.69 26.78,44.38 | R47.2 57.38,48.49 | 57.38,48.49 R43.2 R44.2 R42.2 | 51.11,48.41 57.3,48.41 57.38,48.49 | 51.11,48.41 50.37,48.41 | 50.37,48.41 49.89,48.41 | R52.2 | R52.2 49.87,48.92 50.37,48.41 | C24.2 46.51,39.52 50.55,43.56 50.55,47.04 | 50.55,47.55 50.55,47.85 51.11,48.41 | 50.55,47.04 50.19,47.4 49.2,47.4 | 50.55,47.04 50.55,47.55 | 50.55,47.55 50.04,48.06
  Bottom 0.254: 19.43,49.15 20.25,48.34 v20.48,48.34
  Bottom 0.61: v38.77,26.54 v46.79,26.54
  Bottom 0.813: v20.22,66.45 19.43,65.66 19.43,49.15 26.37,42.22 v28.26,42.22
5V  (via drill 0.3)
  Top 0.254: U4.3 v20.5,15.24 20.51,15.25 22.25,15.25
  Top 0.305: 22.25,15.25 D5.C 22.94,14.56 C16.1 26.9,14.56 R18.2
  Top 0.61: USB.VBUS1 14.49,52.16 v14.51,52.17 | USB.VBUS2 14.47,47.26 v14.51,47.22
  Bottom 0.61: v14.51,52.17 v14.51,47.22 14.51,21.23 v20.5,15.24
  pour Top: 19.38,15.95 23.75,15.95 24.69,15.01 27.38,15.01 27.38,14 27.38,13.84 19.89,13.84 19.38,14.35
+3V3  (via drill 0.3)  (2 unrouted)
  Top 0.254: 18.25,12.39 C22.1 U4.2 U4.4 R10.2 18.27,22.73 19.28,23.75 20.25,23.75 | 18.25,12.39 18.25,11.85 R22.2 | 18.25,12.39 18.4,12.54 PWR.A R1.1 | 16.47,38.41 J2.3 | v26.49,75.24 v26.5,75.23 | 20.25,23.75 IC1.6 IC1.5 | 20.2,23.8 20.25,23.75
  Top 0.61: SD.4 v46.82,68.46 48.7,66.58 48.7,58.95 | 48.7,58.95 48.7,58.88 | 48.7,58.88 48.7,58.29 | 48.7,58.29 49.36,58.29 | R9.2 48.11,58.29 | 48.11,58.29 48.7,58.29 | 50.37,58.1 49.98,58.1 R4.2 49.38,58.29 49.36,58.29 | 50.37,58.1 D4.4 | 50.37,58.1 C54.2 50.37,55.24 C5.2 50.35,54.63 | C10.1 50.35,54.63 | 51.16,54.69 R5.2 R6.2 55.17,54.69 | 51.16,54.69 50.4,54.69 50.35,54.63 | R7.2 R8.2 56.04,58.37 56.04,57.2 C3.2 C9.1 55.86,54.63 | 55.86,54.63 55.86,54 | 55.86,54 R16.2 R17.2 | 55.3,54.69 55.81,54.69 55.86,54.63 | 55.17,54.69 55.3,54.69 | 55.3,54.69 55.83,55.22 | 55.17,54.69 55.86,54 | 51.16,54.69 50.42,53.95 50.37,53.95 | 51.16,54.69 50.37,55.47 50.37,55.78 | 48.7,58.88 48.11,58.29 | 48.7,58.95 49.36,58.29 | 50.4,57.43 51.06,58.09 | 50.3,57.51 49.61,58.19
  Top 0.813: 16.47,38.41 v18.06,38.41 | J1.3 18.05,63.05 v18.06,63.04 19.54,63.04 R27.2 | v18.77,22.94 18.27,22.43 R10.2 | v40.03,75.23 v40.03,75.24 v26.49,75.24 U1.2
  Bottom 0.813: v26.5,75.23 18.06,66.8 v18.06,63.04 v18.06,38.41 18.06,23.65 v18.77,22.94 | v40.03,75.23 v40.04,75.23 v46.82,68.46
  pour Top: 21.47,24.33 19.46,24.33 17.22,22.1 17.22,16.64 17.73,16.13 17.73,11.38 19.03,11.38 20.07,10.34 21.19,10.34 21.19,13.23 19.33,13.23 18.8,13.77 18.8,16.18 19.33,16.71 19.33,19.53 18.82,20.04 18.82,22.15 20.35,23.67 21.44,23.67 21.47,23.67
D+  (via drill 0.3)
  Top 0.254: USB-TTL.A6 IC1.3
  Top 0.305: USB-TTL.B6 12.54,24.25 v12.07,23.77 | USB-TTL.A6 12.2,25.25 v12.04,25.4
  Bottom 0.305: v12.07,23.77 12.07,25.38 v12.04,25.4
D-
  Top 0.254: IC1.4 USB-TTL.A7
  Top 0.305: USB-TTL.A7 11.41,24.74 11.08,25.07 11.08,25.63 11.41,25.96 12.42,25.96 12.63,25.75 USB-TTL.B7
DTR  (via drill 0.3)
  Top 0.254: IC1.23 v22.38,27.76 | R26.2 16.75,10.2 v14.86,10.2
  Top 0.305: Q3.2 v14.86,10.2
  Bottom 0.254: v14.86,10.2 14.86,12.47 15.32,12.93 21.24,12.93 22.38,14.07 v22.38,27.76
GND  (via drill 0.3)
  Top 0.254: IC1.2 22.38,25.75 IC1.THERM
  other vias: 58.32,79.91 59.67,81.81 56.37,82.32 53.9,80.85 60.23,79.07 8.05,79.63 7.65,82.6 9.99,80.8 34.6,45.21 33.43,39.93 25.91,38.33 31.27,38.2 38.33,38.23 42.04,42.85 29.57,43.66 32.97,43.69 25.23,45.31 21.54,53.52 23.78,56.69 30.51,54.33 30.53,52.25 29.16,71.58 33.05,71.73 31.07,68.78 32.41,69.8 32.97,65.53 32.92,62.23 30.91,64.57 31.4,61.54 34.04,68.17 38.08,72.24 38.08,70.82 37.8,66.55 38.81,68.33 37.01,63.65 28.68,76.78 30.33,76.81 32.24,76.81 34.12,76.81 36.25,76.81 38.36,76.81 40.34,76.91 50.83,73.81 52.38,76.07 56.8,70.59 56.77,68.68 58.37,73.05 58.25,65.74 53.85,71.17 47.78,73.76 50.52,67.97 51.39,65.13 51.49,63.6 47.25,66.73 44.63,57.12 47.22,54.53 45.57,56.06 44.53,59.28 58.55,60.83 58.8,57.12 58.85,51.51 59.03,47.07 58.47,41.66 55.5,41.83 56.92,33.38 57.81,24.99 57.81,35.76 57.53,28.47 59.62,1.6 57.38,1.6 59.97,4.88 55.45,13.26 52.2,8.84 42.73,6.3 46.61,7.95 47.22,16.15 44.33,20.68 50.32,21.49 52.68,4.95 30.51,3.51 21.16,3.28 11.38,3.94 7.75,4.95 6.4,1.24 9.15,1.98 9.35,10.54 9.4,17.02 14.1,16.54 23.35,25.86 23.98,25.83 23.88,25.07 23.93,24.18 23.19,24.13 23.19,24.97 24.92,22.23 27.54,20.88 35.13,14.5 35.97,16.61 36.05,22.02 8.56,24.05 8.64,26.16 8.08,27.28 9.05,35.79 9.25,38.23 9.53,40.36 8.36,48.18 8.36,49.23 8.59,50.67 9.12,60.02 9.15,62.33 9.3,64.41 8.08,73.05 8.03,74.78 6.28,80.57 11.08,76.68 11.66,39.55 12.32,34.75 16.34,44.4 21.77,39.32 19.51,27.74 20.4,32.59 28.4,23.01 27.66,18.36 28.22,10.64 26.65,7.82 30.2,7.87 37.21,9.42 40.29,16.97 34.12,24.31 36.63,18.92 44.61,17.27 57.46,18.39 15.62,3.94 26.85,3.99 38.33,3.43 7.6,16.61 7.75,10.57 12.47,17.3 13.85,14.71 9.71,22.83 9.81,25.12 9.99,27.48 16.06,30.58 10.16,47.75 10.57,49.68 10.16,51.82 14,56.77 12.35,60.12 12.55,62.69 12.58,65.86 12.17,70.59 10.92,74.22 40.64,52.7 49.15,51.82 54.08,52.45 45.14,54.76 44.53,41.4 47.3,43.18 34.67,37.69 28.55,37.21 22.94,41.02 45.01,33.2 51.34,33.4 52.61,26.62 32.13,67.67 33.45,67.41 32.82,68.78 33.68,69.67 31.32,70.1 31.24,67.56 23.29,77.27 14.51,76.33 15.12,70.87 13.82,67.51 15.6,67.59 52.23,40.79 51.82,34.49 52.15,38.23 55.71,37.13 58.65,31.62 52.45,22.33 56.75,21.34 54.49,15.34 56.37,3.78 32.31,10.79 27.23,19.86 28.04,12.85 34.47,13.34 34.42,23.16 19.43,26.77 12.07,30.56 5.69,4.7
  pour Top (rank 6): -0.95,85 -0.95,0 66.05,0 66.05,85
  pour Bottom (rank 6): 0.05,0 66.05,0 66.05,85 0.05,85
HMISO
  Top 0.305: D6.- 37.18,52.76 R2.1
IM1
  Top 0.305: P5.39 23.78,48.97 23.27,49.48 R36.1 22.02,50.98 R35.2
IO0  (via drill 0.3)
  Top 0.254: R22.1 v16.02,11.84 | v42.73,58.88 42.73,59.96 U1.27 | 15.71,11.84 v16.02,11.84 | v16.02,11.84 v16.03,11.84
  Top 0.305: R22.1 15.71,11.84 13.55,11.84 Q3.3 10.7,14.69 FLASH.2
  Bottom 0.254: v16.03,11.84 46.76,11.84 54.23,19.3 54.23,43.18 42.73,54.69 v42.73,58.88
IO1/CS  (via drill 0.3)
  Top 0.305: R8.1 54.13,58.5 D4.1 52.73,67.9 49.97,70.66 v46.89,70.66 SD.2 | U1.39 44.02,75.24 v44.58,75.23
  Bottom 0.305: v46.89,70.66 44.58,72.97 v44.58,75.23
IO2/MOSI  (via drill 0.3)
  Top 0.305: SD.3 v47.07,69.56 49.79,66.84 R4.1 51.14,59.82 D4.3 | U1.38 v43.89,73.97
  Bottom 0.305: v47.07,69.56 43.89,72.73 v43.89,73.97
IO3/DB8  (via drill 0.3)
  Top 0.254: P5.25 30.78,46.21 31.27,45.72 v31.91,45.72 | U1.15 27.03,60.05 27.54,60.55 v29.92,60.55
  Bottom 0.254: v31.91,45.72 30.99,46.63 30.99,50.65 29.77,51.87 29.77,60.4 v29.92,60.55
IO4/DB15  (via drill 0.3)
  Top 0.254: U1.4 v26.39,72.7 v26.39,72.69 | v27.38,48.69 27.28,48.59 P5.32
  Bottom 0.254: v26.39,72.69 26.39,49.68 v27.38,48.69
IO5/DB14  (via drill 0.3)
  Top 0.254: P5.31 27.78,45.94 v27.46,45.62 | U1.5 v27.03,71.43 v27.03,71.42
  Bottom 0.254: v27.46,45.62 27.94,46.1 27.94,49 26.88,50.06 26.88,71.27 v27.03,71.42
IO6/DB13  (via drill 0.3)
  Top 0.254: P5.30 28.28,45.37 v27.87,44.96 | U1.6 v27.48,70.16 v27.49,70.16
  Bottom 0.254: v27.87,44.96 28.45,45.54 28.45,49.3 27.36,50.39 27.36,70.03 v27.49,70.16
IO7/DB12  (via drill 0.3)
  Top 0.254: P5.29 v28.78,44.78 | v27.99,68.89 U1.7
  Bottom 0.254: v28.78,44.78 28.93,44.93 28.93,49.63 28.69,49.87 27.84,50.72 27.84,68.73 v27.99,68.89
IO8/DB9  (via drill 0.3)
  Top 0.254: P5.26 30.28,46 v31.27,45.01 | v29.47,62.53 v29.47,62.54 U1.12
  Bottom 0.254: v31.27,45.01 30.46,45.82 30.46,50.44 29.29,51.61 29.29,62.36 v29.47,62.53
IO9/DB7
  Top 0.305: P5.24 31.28,56.38 29.57,58.09 U1.17
IO10/DB6
  Top 0.305: P5.23 31.78,57.12 30.84,58.06 U1.18
IO11/DB5
  Top 0.305: P5.22 32.28,58.57 U1.19
IO12/DB4
  Top 0.305: P5.21 32.78,57.44 33.38,58.04 U1.20
IO13/DB3
  Top 0.305: P5.20 33.28,56.7 34.65,58.06 U1.21
IO14/DB2
  Top 0.305: P5.19 33.78,55.95 35.92,58.09 U1.22
IO15/DB11  (via drill 0.3)
  Top 0.254: P5.28 29.28,45.27 v29.75,44.81 | U1.8 v28.45,67.62 v28.45,67.61
  Bottom 0.254: v29.75,44.81 29.44,45.11 29.44,49.91 28.32,51.03 28.32,67.49 v28.45,67.61
IO16/DB10  (via drill 0.3)
  Top 0.254: P5.27 29.78,45.63 v30.51,44.91 | U1.9 v28.93,66.34
  Bottom 0.254: v30.51,44.91 29.95,45.47 29.95,50.16 28.81,51.31 28.81,66.22 v28.93,66.34
IO17  (via drill 0.3)
  Top 0.406: U1.10 24.24,65.08 v24.11,64.95 | R31.2 24.08,64.92 v24.11,64.95 | J1.1 v20.57,59.05 v20.58,59.05 | v24.11,64.95
  Bottom 0.406: v20.58,59.05 20.58,61.42 v24.11,64.95
IO18
  Top 0.406: U1.11 24.41,63.81 22.15,61.54 21.26,61.54 R23.2 19.59,61.52 R27.1 19.12,61.05 J1.2
IO21/DB1
  Top 0.305: P5.18 34.28,55.16 37.19,58.06 U1.23
IO33/DB0
  Top 0.305: P5.17 34.78,54.21 38.46,57.89 U1.24
IO34/LCD_RD
  Top 0.305: P5.12 37.28,48.99 38.41,50.11 38.41,56.44 39.73,57.76 U1.25
IO35/LCD_WR  (via drill 0.3)
  Top 0.254: P5.11 37.78,45.68 v37.77,45.67 | U1.28 v37.49,61.27
  Bottom 0.254: v37.77,45.67 37.49,45.95 v37.49,61.27
IO36/LCD_RS  (via drill 0.3)
  Top 0.254: P5.10 38.28,48.11 v38.1,48.28 | U1.29 v38.11,62.54 v38.1,62.53
  Bottom 0.254: v38.1,48.28 v38.1,62.53
IO37/LCD_CS  (via drill 0.3)
  Top 0.254: v39.55,49.99 v39.54,50 R34.2 | U1.30 v38.72,63.81 v38.71,63.8
  Top 0.305: P5.9 38.78,49.22 v39.55,49.99 39.55,50.92 R34.2
  Bottom 0.254: v38.71,63.8 38.71,50.83 v39.55,49.99
IO38/TWI_SDA  (via drill 0.3)
  Top 0.254: U1.31 v41.61,65.08 | 55.06,46.62 U8.9 52.64,46.62 51.87,45.85 51.87,42.9 48.3,39.33 P3.4 48.3,23.71 v48.31,23.7 | 55.06,46.62 R44.1 | v54.97,46.48 54.97,46.53 55.06,46.62 | v39.98,23.7 39.74,23.94 P2.2 39.74,28.31 39.37,28.68 21.18,28.68 v19.05,30.81 | J2.2 v19.05,36.4
  Bottom 0.254: v54.97,46.48 54.41,47.04 54.41,48.74 49.18,53.98 49.18,57.51 v41.61,65.08 | v39.98,23.7 v48.31,23.7 | v19.05,30.81 v19.05,36.4
IO39/TWI_SCK  (via drill 0.3)
  Top 0.254: 55.1,47.12 U8.10 52.28,47.12 51.36,46.2 51.36,43.2 47.8,39.64 P3.3 47.8,24.58 v47.53,24.31 | 55.1,47.12 55.68,47.12 R43.1 | v55.07,47.24 55.1,47.24 55.1,47.12 | U1.32 v41.61,66.35 v41.61,66.34 | v40.54,24.31 40.24,24.61 P2.3 40.24,28.6 39.7,29.13 21.85,29.13 16.58,34.4 J2.1
  Bottom 0.254: v47.53,24.31 v40.54,24.31 | v41.61,66.34 49.79,58.17 49.79,54.13 55.07,48.84 v55.07,47.24
IO40  (via drill 0.3)
  Top 0.254: U8.7 | U1.33 v41.59,67.62 v41.58,67.61 | U8.7 54.13,45.62 54.93,44.82 | 54.93,44.82 55.44,44.31 R42.1 | v54.99,44.91 54.93,44.84 54.93,44.82 | v49.03,24.84 48.8,25.07 P3.5 48.8,39.07 52.4,42.67 52.4,45.26 52.76,45.62 U8.7 | P2.4 40.74,25.05 v40.85,24.94
  Bottom 0.254: v41.58,67.61 50.37,58.83 50.37,54.3 55.71,48.97 55.71,45.62 v54.99,44.91 | v40.85,24.94 48.92,24.94 v49.03,24.84
IO41/MISO  (via drill 0.3)
  Top 0.305: D4.6 52.75,58.1 v53.41,57.44 53.57,57.28 R6.1 | SD.7 45.13,65.2 47.3,65.2 v47.48,65.38 | v43.74,69.01 42.89,69.01 U1.34
  Bottom 0.305: v53.41,57.44 53.34,57.51 53.34,59.41 47.87,64.88 47.48,65.28 | v43.74,69.01 47.48,65.28 | v47.48,65.38 47.48,65.28
IO42/SCLK  (via drill 0.3)
  Top 0.305: R5.1 51.98,56.26 v51.98,57.56 D4.5 | SD.5 v44.17,67.36 | U1.35 v41.56,70.16 U1.35
  Bottom 0.305: 44.17,67.54 51.98,59.73 v51.98,57.56 | v44.17,67.36 44.17,67.54 | 44.17,67.54 44.15,67.56 v41.56,70.16
IO45  (via drill 0.3)
  Top 0.254: R41.2 v30.38,55.9 v30.38,55.91 | U1.26 41,59.66 40.69,59.97 v30.38,59.97
  Bottom 0.254: v30.38,55.91 v30.38,59.97
N$1
  Top 0.254: IC1.16 26.59,25.25 C4.2
N$2
  Top 0.254: Q4.1 18.36,10.11 R26.1
N$3
  Top 0.305: R25.1 12.37,10.04 Q3.1
N$4
  Top 0.305: P5.14 36.28,49.87 D6.+ 36.4,50.96 R2.2
N$5
  Top 0.305: Q2.1 31.33,20.08 R45.2 29.62,20.12 R50.1
N$6
  Top 0.305: USB.A5 14.72,50.96 R15.2
N$7
  Top 0.406: PWR.C R19.2
N$8
  Top 0.406: R18.1 28.66,16.03 LED1.1
N$9
  Top 0.406: Q2.3 33.43,16.84 LED1.2
N$10
  Top 0.305: USB-TTL.A5 16.42,26.25 R13.2
N$11
  Top 0.305: USB-TTL.B5 15.38,23.25 R12.2
N$12
  Top 0.254: R10.1 20.73,21.29 | 20.73,21.29 21.19,21.29 R11.1 | 20.73,21.29 20.73,21.91 21.82,23 IC1.7
  pour Top: 21.92,23.29 20.86,23.29 19.36,21.79 19.36,20.52 21.85,20.52 21.92,20.52
N$13
  Top 0.406: U$15.4 R3.2
N$14
  Top 0.305: USB.B5 15.72,47.96 R14.2
N$15
  Top 0.305: R20.2 17.68,53.34 23.9,59.56 23.9,60.58 24.59,61.27 U1.13
N$16
  Top 0.305: U1.14 18.6,53.33 18.6,50.14 R21.2
N$17
  Top 0.61: C12.2 21.63,70.98 C2.1 18.67,69.86 R3.1 R28.1
N$18
  Top 0.254: IC1.21 23.38,27.88 23.73,28.22 27.46,28.22 R29.2
N$19
  Top 0.254: IC1.20 23.88,27.59 24.06,27.76 26.23,27.76 R30.2
N$20
  Top 0.305: P5.34 26.28,50.82 R37.1
N$21
  Top 0.305: P5.35 25.78,50.5 R38.1
N$22
  Top 0.305: P5.36 25.28,49.46 R39.1
N$23  (1 unrouted)
  Top 0.254: 27.74,54.36 28.15,53.95 28.15,53.75
  Top 0.305: Q1.1 26.92,54.27 R24.2 28.17,54.38 | 28.17,54.38 R41.1 | R40.1 28.16,54.37 28.17,54.38
N$24
  Top 0.305: R37.2 R38.2 R39.2 23.58,55.08 Q1.3
N$25  (via drill 0.3)
  Top 0.254: U8.8 54.49,46.12 v54.84,45.77 | R52.1 R49.2 | R49.2 | R49.2 v52.31,49.92 v52.3,49.91
  Bottom 0.254: v54.84,45.77 53.83,46.79 53.83,48.39 v52.3,49.91
N$26  (via drill 0.3)
  Top 0.406: v23.22,70.08 R46.2 | 21.68,67.68 21.68,67.22 v21.67,67.21 21.67,67.84 U$15.6
  Bottom 0.406: v23.22,70.08 21.67,68.53 v21.67,67.21
N$27
  Top 0.406: U$15.3 22.9,69.15 22.61,68.86 22.61,66.67 21.24,65.3 R23.1
N$28
  Top 0.406: U$15.1 23.53,65.9 R31.1
N$29
  Top 0.61: R48.1 21.47,74.92 C13.1 21.76,74.62 C14.2 R46.1
N$47
  Top 0.305: SD.1 50.49,71.76 53.62,68.63 53.62,61.09 R7.1
N$48
  Top 0.305: SD.8 46.08,64.06 47.58,62.56 R9.1
PWM_AUDIO_L
  Top 0.813: SPK.- 17.75,72.84 R32.1 C2.2
PWM_AUDIO_R
  Top 0.813: SPK.+ 17.77,74.84 R51.1 C13.2
RESET  (via drill 0.3)
  Top 0.254: P5.15 35.78,44.99 v35.79,44.98 | R47.1 | P3.6 49.3,35.43 C8.1 | P2.5 41.24,26.07 v41.68,25.63
  Top 0.305: RST.2 9.75,8.29 | Q4.3
  Top 0.61: 9.75,8.29 11.52,6.52 Q4.3 36.07,6.52 41.68,12.14 v41.68,25.63 | v49.51,25.63 49.46,25.68 49.46,35.61 | 49.46,35.61 49.46,37.29 | 49.46,37.29 49.46,38.58 v50.3,39.42 v57.38,39.42 | C8.1 49.61,35.76 49.46,35.61 | C1.2 49.53,37.36 49.46,37.29 | U1.3 v35.79,73.97 | R47.1 v57.38,51.38 R17.1 R16.1
  Bottom 0.61: v57.38,39.42 v57.38,51.38 | v41.68,25.63 v49.51,25.63 | v35.79,73.97 v35.79,44.98 41.35,39.42 v50.3,39.42
RTS  (via drill 0.3)
  Top 0.254: IC1.19 26.17,27 v26.34,26.82 | v15.45,8.43 16.33,8.43 Q4.2
  Top 0.305: R25.2 v15.45,8.43
  Bottom 0.254: v26.34,26.82 26.34,16.18 22.58,12.42 15.65,12.42 15.45,12.22 v15.45,8.43
RXD/IO44  (via drill 0.3)
  Top 0.254: v39.83,71.42 U1.36 | R29.1 31.13,27.22 v31.17,27.25
  Bottom 0.254: v39.83,71.42 40.16,71.09 40.16,55.35 53.17,42.34 53.17,31.67 49.23,27.74 31.65,27.74 v31.17,27.25
TXD/IO43  (via drill 0.3)
  Top 0.254: R30.1 32.19,25.36 v32.19,26.98 | v40.64,72.69 v40.65,72.7 U1.37
  Top 0.305: R50.2 31.17,21.77 R30.1
  Bottom 0.254: v40.64,72.69 40.64,55.68 53.72,42.6 53.72,31.37 49.58,27.23 32.44,27.23 v32.19,26.98
USB_D+
  Top 0.305: R21.1 15.89,48.96 USB.B6 12.67,48.96 12.47,49.15 12.47,49.78 12.65,49.96 | 12.65,49.96 | USB.A6 12.65,49.96
USB_D-
  Top 0.254: 14.2,50.47 14.58,50.09 14.58,50.06 14.99,50.47 15.17,50.47
  Top 0.305: USB.B7 14.63,50.46 | 14.63,50.46 15.84,50.46 R20.1 | USB.A7 14.28,49.46 14.58,49.76 14.58,50.06 14.58,50.41 14.63,50.46
VBUS  (via drill 0.3)
  Top 0.254: IC1.8 22.38,22.2 22.99,21.59 R11.2 | C6.2 R11.2 | D5.A 22.99,19.02 R11.2
  Top 0.61: USB-TTL.VBUS2 v15.39,22.55 v15.4,22.55 | USB-TTL.VBUS1 15.93,27.45 | 15.93,27.45 16.07,27.45 C7.2 | v15.4,27.46 15.92,27.46 15.93,27.45 | v20.98,18.77 21,18.79 D5.A
  Bottom 0.61: v15.4,27.46 v15.4,22.55 19.18,18.77 v20.98,18.77
  pour Top: 24.95,21.46 23.42,21.46 22.56,22.33 22.56,23.29 22.3,23.29 22.3,21.89 22.38,21.82 22.38,20.19 21.95,19.76 20.75,19.76 20.75,17.86 24.79,17.86 24.95,17.86
XL
  Top 0.254: U8.4 47.7,45.62 46.33,46.99 42.79,46.99 P5.1
XR  (1 unrouted)
  Top 0.254: U8.2 48.23,46.62 46.31,48.54 42.12,48.54 41.79,48.21 41.79,47.04
YD  (via drill 0.3)
  Top 0.254: U8.3 47.99,46.12 46.33,47.78 v45.39,47.78 | P5.4 41.28,47.95 v41.2,48.03
  Bottom 0.254: v45.39,47.78 44.81,48.36 41.53,48.36 v41.2,48.03
YU  (via drill 0.3)
  Top 0.254: P5.2 42.28,47.89 42.47,48.08 44.02,48.08 v44.33,47.78 | v46.66,45.44 46.98,45.12 U8.5
  Bottom 0.254: v44.33,47.78 v46.66,45.44

### Text on the board
tPlace: + | - | GND | +3V3 | IO18 | IO17 | GND | +3V3 | IO38 | IO39 | www.makerfabs.com | ESP32-S2 Parallel TFT | with Touch v1.1 | (3.5'' ili9488)